# Altium project bdcmc_25.PrjPcb (part 1 of 2)
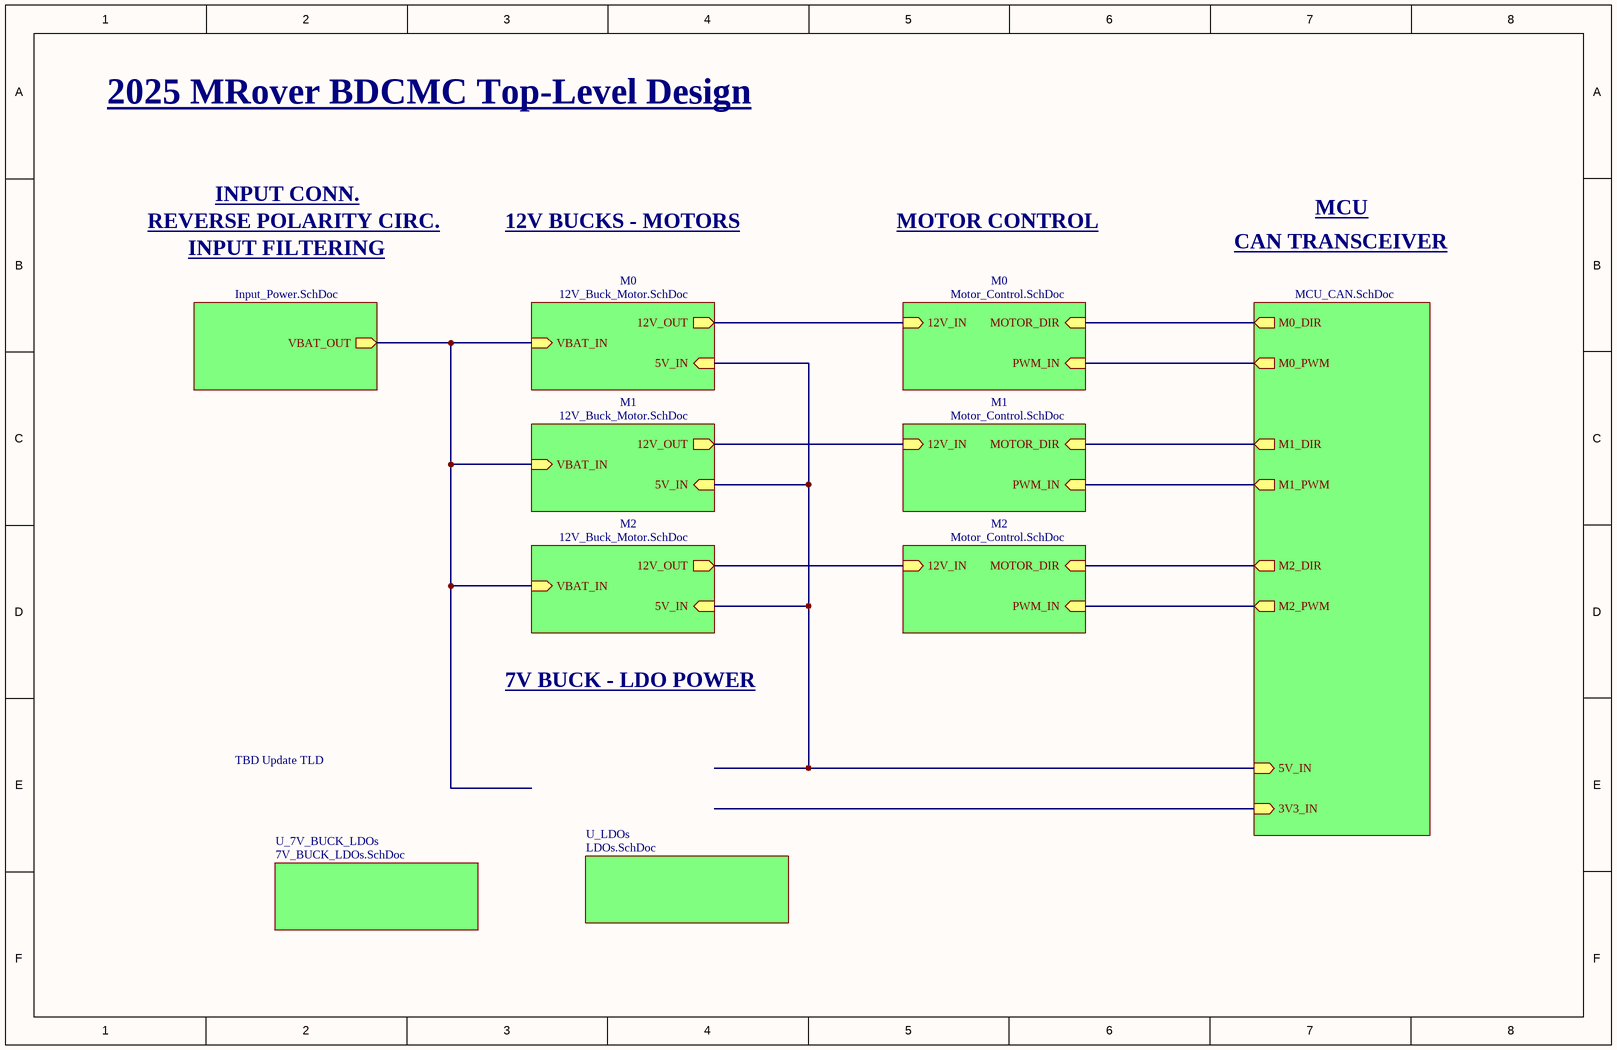
[diagram p0: TLD.SchDoc]
7 sheets, 368 parts. Net scope: hierarchical (ports join the sheet entries above them; power ports are global).
Board files: bdcmc25.PcbDoc, bdcmc25_revised.PcbDoc
Sheets:
  TLD.SchDoc
    Input Power = Input_Power.SchDoc
    M0 = 12V_Buck_Motor.SchDoc
    M1 = 12V_Buck_Motor.SchDoc
    M2 = 12V_Buck_Motor.SchDoc
    M0 = Motor_Control.SchDoc
    M1 = Motor_Control.SchDoc
    M2 = Motor_Control.SchDoc
    Designator = MCU_CAN.SchDoc
    U_7V_BUCK_LDOs = 7V_BUCK_LDOs.SchDoc
    U_LDOs = LDOs.SchDoc

## Sheet TLD.SchDoc
size 302 x 195 mm; SheetNumber: 1; SheetTotal: 7

### Sub-sheets
Designator = MCU_CAN.SchDoc: M0_DIR (out), M0_PWM (out), M1_DIR (out), M1_PWM (out), M2_DIR (out), M2_PWM (out), 5V_IN (in), 3V3_IN (in)
Input Power = Input_Power.SchDoc: VBAT_OUT (out)
M0 = 12V_Buck_Motor.SchDoc: VBAT_IN (in), 12V_OUT (out), 5V_IN (in)
M0 = Motor_Control.SchDoc: 12V_IN (in), MOTOR_DIR (in), PWM_IN (in)
M1 = 12V_Buck_Motor.SchDoc: VBAT_IN (in), 12V_OUT (out), 5V_IN (in)
M1 = Motor_Control.SchDoc: 12V_IN (in), MOTOR_DIR (in), PWM_IN (in)
M2 = 12V_Buck_Motor.SchDoc: VBAT_IN (in), 12V_OUT (out), 5V_IN (in)
M2 = Motor_Control.SchDoc: 12V_IN (in), MOTOR_DIR (in), PWM_IN (in)
U_7V_BUCK_LDOs = 7V_BUCK_LDOs.SchDoc: no entries
U_LDOs = LDOs.SchDoc: no entries

### Nets
5V: sheet M0/5V_IN, sheet M1/5V_IN, sheet M2/5V_IN, sheet Designator/5V_IN
12V_MOTOR: sheet M0/12V_OUT, sheet M1/12V_OUT, sheet M2/12V_OUT, sheet M0/12V_IN, sheet M1/12V_IN, sheet M2/12V_IN
VBAT: sheet Input Power/VBAT_OUT, sheet M0/VBAT_IN, sheet M1/VBAT_IN, sheet M2/VBAT_IN
MOTOR_DIR: sheet M0/MOTOR_DIR, sheet Designator/M0_DIR
MOTOR_DIR: sheet M1/MOTOR_DIR, sheet Designator/M1_DIR  [a separate net that carries the same name]
MOTOR_DIR: sheet M2/MOTOR_DIR, sheet Designator/M2_DIR  [a separate net that carries the same name]
PWM_IN: sheet M0/PWM_IN, sheet Designator/M0_PWM
PWM_IN: sheet M1/PWM_IN, sheet Designator/M1_PWM  [a separate net that carries the same name]
PWM_IN: sheet M2/PWM_IN, sheet Designator/M2_PWM  [a separate net that carries the same name]

### Notes on the sheet
- 2025 MRover BDCMC Top-Level Design
- REVERSE POLARITY CIRC.
- INPUT FILTERING
- INPUT CONN.
- 12V BUCKS - MOTORS
- MOTOR CONTROL
- CAN TRANSCEIVER
- MCU
- 7V BUCK - LDO POWER
- TBD Update TLD
- DWG. NO.
- REV.
- SHT.
- REVISION
- DESCRIPTION
- DATE
- APPROVED
- THIS DOCUMENT AND THE DATA DISCLOSED HEREIN OR HEREWITH IS THE PROPERTY OF ALTIUM LIMITED AND MAY BE FREELY DISTRIBUTED IN WHOLE. NO RIGHTS ARE RESERVED OR EXPRESS OR IMPLIED WARANTEE GIVEN.
- ENG:
- DSN:
- APPROVALS
- PROJECT
- DOCUMENT REVISION:
- DESIGN ITEM:
- CHK:
- BOM:
- REFERENCE DOCUMENTS
- PROJECT REVISION:
- TITLE
- FAB DWG:
- PCB DWG:
- ASSY DWG:
- SCALE:
- SIZE
- C
- CAGE CODE
- FILE NAME
- DWG NO.
- SHEET
- OF
- REV

## Sheet Input_Power.SchDoc
size 194 x 125 mm; SheetNumber: 2; SheetTotal: 7
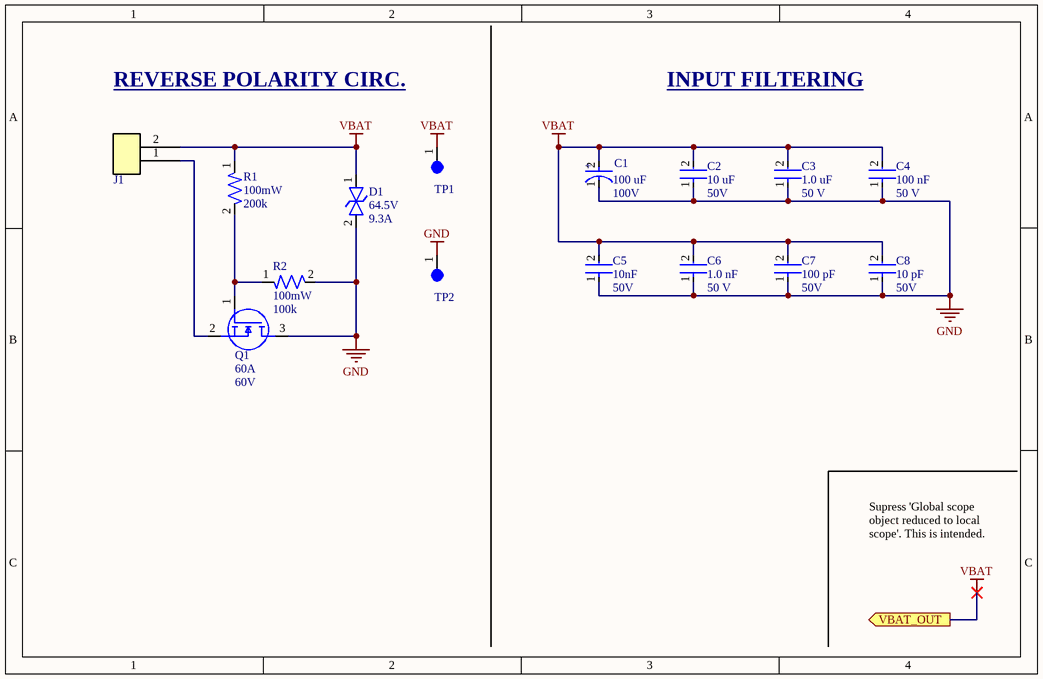
[diagram p1: Input_Power.SchDoc]

### Parts
C1  Voltage: 100V  Capacitance: 100 uF  [CAP-100U-0001]  (hidden comment: EEETK2A101AM)
C2  Voltage: 50V  Capacitance: 10 uF  [CAP-1210]  (hidden comment: CL32B106KBJNNNE)
C3  Voltage: 50 V  Capacitance: 1.0 uF  [CAP-0805]  (hidden comment: CC0805KKX7R9BB105)
C4  Voltage Rating: 50 V  Capacitance: 100 nF  [CAP-0805]  (hidden comment: CC0805KRX7R9BB104)
C5  Voltage: 50V  Capacitance: 10nF  [CAP-0805]  (hidden comment: GRM2195C1H103JA01D)
C6  Voltage: 50 V  Capacitance: 1.0 nF  [CAP-0402]  (hidden comment: CC0402KRX7R9BB102)
C7  Capacitance: 100 pF  Voltage: 50V  [CAP-0402]  (hidden comment: CC0402JRNPO9BN101)
C8  Capacitance: 10 pF  Voltage: 50V  [CAP-0402]  (hidden comment: CC0402JRNPO9BN100)
D1  Voltage Rating: 64.5V  Current Rating: 9.3A  [DO-214AA (SMBJ)]  (hidden comment: SMBJ40CA)
J1  0436500215  [CONN-2POS-0002]  (value not drawn)
Q1  Voltage: 60V  Continuous Current: 60A  [IC-8VSONCLIP]  (hidden comment: CSD18543Q3AT)
R1  Power: 100mW  Resistance: 200k  [RES-0603]  (hidden comment: RC0603FR-07200KL)
R2  Power: 100mW  Resistance: 100k  [RES-0603]  (hidden comment: RC0603FR-07100KL)
TP1  5003  [TEST-POINT-0001]  (value not drawn)
TP2  5003  [TEST-POINT-0001]  (value not drawn)

### Ports
VBAT_OUT (out, see TLD[7E])

### Nets
GND: C1.1 C2.1 C3.1 C4.1 C5.1 C6.1 C7.1 C8.1 D1.2 Q1.3(D) R2.2 TP2.1
VBAT: C1.2 C2.2 C3.2 C4.2 C5.2 C6.2 C7.2 C8.2 D1.1 J1.2 R1.1 TP1.1 ; port VBAT_OUT
NetJ1_1: J1.1 Q1.2(S)
NetQ1_1: Q1.1(G) R1.2 R2.1

### Notes on the sheet
- REVERSE POLARITY CIRC.
- INPUT FILTERING
- Supress 'Global scope object reduced to local scope'. This is intended.
- (in symbol CAP-100U-0001) +

### Library data of the parts
C1 = CAP-100U-0001: CAP ALUM 100UF 20% 100V SMD; Device Class: Electrolytic; ComponentLink1Description: Datasheet; ComponentLink1URL: https://industrial.panasonic.com/cdbs/www-data/pdf/RDE0000/ABA0000C1190.pdf
C2 = CAP-10U-0002: CAP CER 10UF 50V X7R 1210; Device Class: Ceramic; Size: 1210; ComponentLink1Description: Datasheet; ComponentLink1URL: https://mm.digikey.com/Volume0/opasdata/d220001/medias/docus/41/CL32B106KBJNNNE_Spec.pdf
C3 = CAP-1U-0001: CAP CER 1UF 50V X7R 0805; ComponentLink2URL: https://www.yageo.com/upload/media/product/productsearch/datasheet/mlcc/UPY-GPHC_X7R_6.3V-to-250V_24.pdf; ComponentLink2Description: Datasheet; Device Class: Ceramic; Size: 0805
C4 = CAP-0.1U-0002: CAP CER 0.1UF 50V X7R 0805; ComponentLink2Description: Datasheet; ComponentLink2URL: https://www.yageo.com/upload/media/product/productsearch/datasheet/mlcc/UPY-GPHC_X7R_6.3V-to-250V_24.pdf; Device Class: Ceramic; Size: 0805
C5 = CAP-10N-0001: CAP CER 10000PF 50V C0G/NP0 0805; Device Class: Ceramic; Size: 0805; ComponentLink1Description: Datasheet; ComponentLink1URL: https://search.murata.co.jp/Ceramy/image/img/A01X/G101/ENG/GRM2195C1H103JA01-01.pdf
C6 = CAP-1N-0001: CAP CER 1000PF 50V X7R 0402; ComponentLink2Description: Datasheet; ComponentLink2URL: http://www.yageo.com/documents/recent/UPY-GP_NP0_16V-to-50V_16.pdf; Device Class: Ceramic; Size: 0402
C7 = CAP-100P-0001: CAP CER 100PF 50V C0G/NPO 0402; Device Class: Ceramic; Size: 0402; ComponentLink1Description: Datasheet; ComponentLink1URL: https://www.yageo.com/upload/media/product/productsearch/datasheet/mlcc/UPY-GP_NP0_16V-to-50V_18.pdf
C8 = CAP-10P-0001: CAP CER 10PF 50V C0G/NPO 0402; Device Class: Ceramic; Size: 0402; ComponentLink1Description: Datasheet; ComponentLink1URL: https://www.yageo.com/upload/media/product/productsearch/datasheet/mlcc/UPY-GP_NP0_16V-to-50V_18.pdf
D1 = DIO-TVS-0001: TVS DIODE 40VWM 64.5VC DO214AA; ComponentLink1Description: Datasheet; ComponentLink1URL: https://www.littelfuse.com/media?resourcetype=datasheets&itemid=09a6ae9a-73cb-4ac4-acac-e6dab92ab953&filename=littelfuse_tvs_diode_smbj_datasheet.pdf
J1 = CONN-2POS-0002: CONN HEADER VERT 2POS 3MM; ComponentLink1Description: Datasheet; ComponentLink1URL: https://www.molex.com/content/dam/molex/molex-dot-com/products/automated/en-us/salesdrawingpdf/436/43650/436500215_sd.pdf?inline
Q1 = NMOS-60A-0001: MOSFET N-CH 60V 12A/60A 8VSON; ComponentLink2Description: Datasheet; ComponentLink2URL: http://www.ti.com/lit/ds/symlink/csd18543q3a.pdf
R1 = RES-200k-0001: RES SMD 200K OHM 1% 1/10W 0603; Tolerance: 1%; Size: 0603; ComponentLink1Description: Datasheet; ComponentLink1URL: https://www.yageo.com/upload/media/product/products/datasheet/rchip/PYu-RC_Group_51_RoHS_L_12.pdf
R2 = RES-100k-0001: RES SMD 100K OHM 1% 1/10W 0603; Tolerance: 1%; Size: 0603; ComponentLink1Description: Datasheet; ComponentLink1URL: https://www.yageo.com/upload/media/product/products/datasheet/rchip/PYu-RC_Group_51_RoHS_L_12.pdf
TP1 TP2 = TEST-POINT-0001: Oranange PC Test Point, Miniature Phoisphor Bronze Silver Plating Through Hole Mounting Type

## Sheet 12V_Buck_Motor.SchDoc
size 259 x 167 mm; SheetNumber: 3; SheetTotal: 7
Used 3 times, as channels M0, M1, M2. Parts and nets are listed once, with the designators drawn on the sheet.
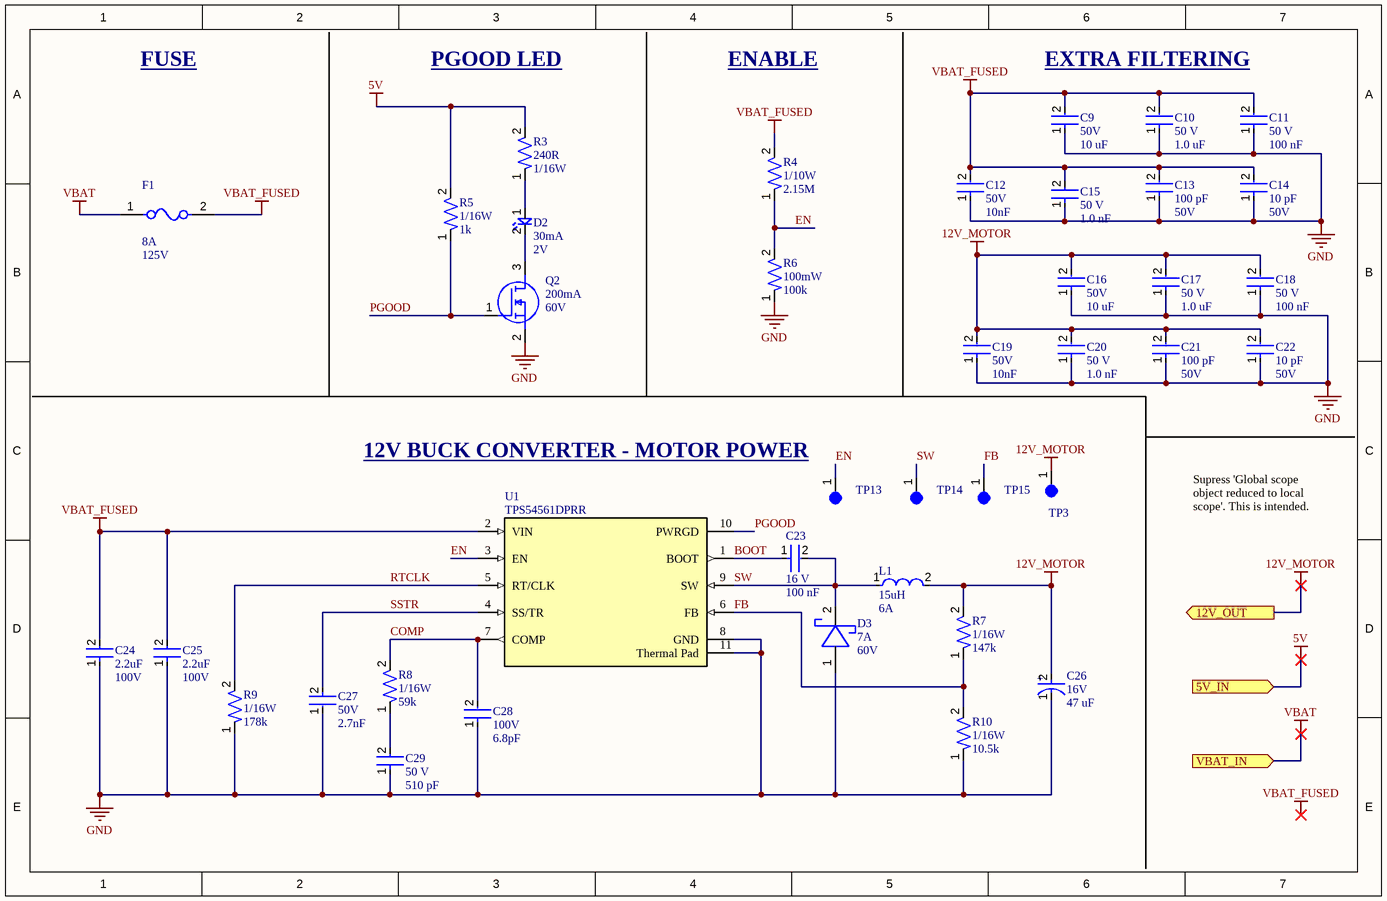
[diagram p2: 12V_Buck_Motor.SchDoc]

### Parts
C9  Voltage: 50V  Capacitance: 10 uF  [CAP-1210]  (hidden comment: CL32B106KBJNNNE)
C10  Voltage: 50 V  Capacitance: 1.0 uF  [CAP-0805]  (hidden comment: CC0805KKX7R9BB105)
C11  Voltage Rating: 50 V  Capacitance: 100 nF  [CAP-0805]  (hidden comment: CC0805KRX7R9BB104)
C12  Voltage: 50V  Capacitance: 10nF  [CAP-0805]  (hidden comment: GRM2195C1H103JA01D)
C13  Capacitance: 100 pF  Voltage: 50V  [CAP-0402]  (hidden comment: CC0402JRNPO9BN101)
C14  Capacitance: 10 pF  Voltage: 50V  [CAP-0402]  (hidden comment: CC0402JRNPO9BN100)
C15  Voltage: 50 V  Capacitance: 1.0 nF  [CAP-0402]  (hidden comment: CC0402KRX7R9BB102)
C16  Voltage: 50V  Capacitance: 10 uF  [CAP-1210]  (hidden comment: CL32B106KBJNNNE)
C17  Voltage: 50 V  Capacitance: 1.0 uF  [CAP-0805]  (hidden comment: CC0805KKX7R9BB105)
C18  Voltage Rating: 50 V  Capacitance: 100 nF  [CAP-0805]  (hidden comment: CC0805KRX7R9BB104)
C19  Voltage: 50V  Capacitance: 10nF  [CAP-0805]  (hidden comment: GRM2195C1H103JA01D)
C20  Voltage: 50 V  Capacitance: 1.0 nF  [CAP-0402]  (hidden comment: CC0402KRX7R9BB102)
C21  Capacitance: 100 pF  Voltage: 50V  [CAP-0402]  (hidden comment: CC0402JRNPO9BN101)
C22  Capacitance: 10 pF  Voltage: 50V  [CAP-0402]  (hidden comment: CC0402JRNPO9BN100)
C23  Voltage Rating: 16 V  Capacitance: 100 nF  [CAP-0402]  (hidden comment: CC0402KRX7R7BB104)
C24  Capacitance: 2.2uF  Voltage: 100V  [CAP-1206]  (hidden comment: CC1206KKX7R0BB225)
C25  Capacitance: 2.2uF  Voltage: 100V  [CAP-1206]  (hidden comment: CC1206KKX7R0BB225)
C26  Voltage: 16V  Capacitance: 47 uF  [CAP-47U-0001]  (hidden comment: 16SVPG47M)
C27  Voltage: 50V  Capacitance: 2.7nF  [CAP-0805]  (hidden comment: GRM2165C1H272JA01D)
C28  Voltage: 100V  Capacitance: 6.8pF  [CAP-0603]  (hidden comment: CC0603CRNPO0BN6R8)
C29  Voltage: 50 V  Capacitance: 510 pF  [CAP-0402]  (hidden comment: 0402N511J500CT)
D2  Forward Current: 30mA  Forward Voltage: 2V  [LED-0603]  (hidden comment: BL-HKC36G-AV-TRB)
D3  Forward Current: 7A  Reverse Voltage (DC): 60V  [DO-POWERDI5]  (hidden comment: PDS760-13)
F1  Fuse Current: 8A  Voltage Rating: 125V  [FUSE-0001]  (hidden comment: 01550900M)
L1  Inductance: 15uH  Current Rating: 6A  [IND-15U-0002]  (hidden comment: CSAD1010-150M)
Q2  Continuous Current: 200mA  Voltage: 60V  [IC-SOT23-3]  (hidden comment: T2N7002AK,LM)
R3  Resistance: 240R  Power: 1/16W  [RES-0402]  (hidden comment: RC0402FR-07240RL)
R4  Power: 1/10W  Resistance: 2.15M  [RES-0603]  (hidden comment: RC0603FR-072M15L)
R5  Power: 1/16W  Resistance: 1k  [RES-0402]  (hidden comment: RC0402FR-071KL)
R6  Power: 100mW  Resistance: 100k  [RES-0603]  (hidden comment: RC0603FR-07100KL)
R7  Power: 1/16W  Resistance: 147k  [RES-0402]  (hidden comment: RC0402FR-07147KL)
R8  Power: 1/16W  Resistance: 59k  [RES-0402]  (hidden comment: RC0402FR-0759KL)
R9  Power: 1/16W  Resistance: 178k  [RES-0402]  (hidden comment: RTT021783FTH)
R10  Power: 1/16W  Resistance: 10.5k  [RES-0402]  (hidden comment: RC0402FR-0710K5L)
TP3  5003  [TEST-POINT-0001]  (value not drawn)
TP13  5003  [TEST-POINT-0001]  (value not drawn)
TP14  5003  [TEST-POINT-0001]  (value not drawn)
TP15  5003  [TEST-POINT-0001]  (value not drawn)
U1  TPS54561DPRR  [IC-10WSON]

### Ports
5V_IN (in, see TLD[5D], 7V_BUCK_LDOs[2B], MCU_CAN[7E]), 12V_OUT (out, see TLD[5E]), VBAT_IN (in, see TLD[6E], 7V_BUCK_LDOs[2B])

### Nets
5V: R3.2 R5.2 ; port 5V_IN
12V_MOTOR: C16.2 C17.2 C18.2 C19.2 C20.2 C21.2 C22.2 C26.2(A) L1.2 R7.2 TP3.1 ; port 12V_OUT
GND: C9.1 C10.1 C11.1 C12.1 C13.1 C14.1 C15.1 C16.1 C17.1 C18.1 C19.1 C20.1 C21.1 C22.1 C24.1 C25.1 C26.1(C) C27.1 C28.1 C29.1 D3.1(CATHODE) Q2.2(S) R6.1 R9.1 R10.1 U1.8(GND) U1.11(Thermal_Pad)
VBAT: F1.1 ; port VBAT_IN
VBAT_FUSED: C9.2 C10.2 C11.2 C12.2 C13.2 C14.2 C15.2 C24.2 C25.2 F1.2 R4.2 U1.2(VIN)
BOOT: C23.1 U1.1(BOOT)
COMP: C28.2 R8.2 U1.7(COMP)
EN: R4.1 R6.2 TP13.1 U1.3(EN)
FB: R7.1 R10.2 TP15.1 U1.6(FB)
PGOOD: Q2.1(G) R5.1 U1.10(PWRGD)
RTCLK: R9.2 U1.5(RT/CLK)
SSTR: C27.2 U1.4(SS/TR)
SW: C23.2 D3.2(ANODE) L1.1 TP14.1 U1.9(SW)
NetC29_2: C29.2 R8.1
NetD2_1: D2.1 R3.1
NetD2_2: D2.2 Q2.3(D)

### Channels
M0: designators end in _M0; ports 5V_IN=5V 12V_OUT=12V_MOTOR VBAT_IN=VBAT
M1: designators end in _M1; ports 5V_IN=5V 12V_OUT=12V_MOTOR VBAT_IN=VBAT
M2: designators end in _M2; ports 5V_IN=5V 12V_OUT=12V_MOTOR VBAT_IN=VBAT

### Notes on the sheet
- FUSE
- PGOOD LED
- ENABLE
- EXTRA FILTERING
- 12V BUCK CONVERTER - MOTOR POWER
- Supress 'Global scope object reduced to local scope'. This is intended.
- Labels drawn without touching a wire or pin: VBAT_FUSED
- DWG. NO.
- REV.
- SHT.
- REVISION
- DESCRIPTION
- DATE
- APPROVED
- THIS DOCUMENT AND THE DATA DISCLOSED HEREIN OR HEREWITH IS THE PROPERTY OF ALTIUM LIMITED AND MAY BE FREELY DISTRIBUTED IN WHOLE. NO RIGHTS ARE RESERVED OR EXPRESS OR IMPLIED WARANTEE GIVEN.
- ENG:
- DSN:
- APPROVALS
- PROJECT
- DOCUMENT REVISION:
- DESIGN ITEM:
- CHK:
- BOM:
- REFERENCE DOCUMENTS
- PROJECT REVISION:
- TITLE
- FAB DWG:
- PCB DWG:
- ASSY DWG:
- SCALE:
- SIZE
- C
- CAGE CODE
- FILE NAME
- DWG NO.
- SHEET
- OF
- REV
- (in symbol CAP-47U-0001) +

### Library data of the parts
C9 C16 = CAP-10U-0002: CAP CER 10UF 50V X7R 1210; Device Class: Ceramic; Size: 1210; ComponentLink1Description: Datasheet; ComponentLink1URL: https://mm.digikey.com/Volume0/opasdata/d220001/medias/docus/41/CL32B106KBJNNNE_Spec.pdf
C10 C17 = CAP-1U-0001: CAP CER 1UF 50V X7R 0805; ComponentLink2URL: https://www.yageo.com/upload/media/product/productsearch/datasheet/mlcc/UPY-GPHC_X7R_6.3V-to-250V_24.pdf; ComponentLink2Description: Datasheet; Device Class: Ceramic; Size: 0805
C11 C18 = CAP-0.1U-0002: CAP CER 0.1UF 50V X7R 0805; ComponentLink2Description: Datasheet; ComponentLink2URL: https://www.yageo.com/upload/media/product/productsearch/datasheet/mlcc/UPY-GPHC_X7R_6.3V-to-250V_24.pdf; Device Class: Ceramic; Size: 0805
C12 C19 = CAP-10N-0001: CAP CER 10000PF 50V C0G/NP0 0805; Device Class: Ceramic; Size: 0805; ComponentLink1Description: Datasheet; ComponentLink1URL: https://search.murata.co.jp/Ceramy/image/img/A01X/G101/ENG/GRM2195C1H103JA01-01.pdf
C13 C21 = CAP-100P-0001: CAP CER 100PF 50V C0G/NPO 0402; Device Class: Ceramic; Size: 0402; ComponentLink1Description: Datasheet; ComponentLink1URL: https://www.yageo.com/upload/media/product/productsearch/datasheet/mlcc/UPY-GP_NP0_16V-to-50V_18.pdf
C14 C22 = CAP-10P-0001: CAP CER 10PF 50V C0G/NPO 0402; Device Class: Ceramic; Size: 0402; ComponentLink1Description: Datasheet; ComponentLink1URL: https://www.yageo.com/upload/media/product/productsearch/datasheet/mlcc/UPY-GP_NP0_16V-to-50V_18.pdf
C15 C20 = CAP-1N-0001: CAP CER 1000PF 50V X7R 0402; ComponentLink2Description: Datasheet; ComponentLink2URL: http://www.yageo.com/documents/recent/UPY-GP_NP0_16V-to-50V_16.pdf; Device Class: Ceramic; Size: 0402
C23 = CAP-0.1U-0001: CAP CER 0.1UF 16V X7R 0402; ComponentLink2Description: Datasheet; ComponentLink2URL: https://www.yageo.com/upload/media/product/productsearch/datasheet/mlcc/UPY-GPHC_X7R_6.3V-to-250V_24.pdf; Device Class: Ceramic; Size: 0402
C24 C25 = CAP-2.2U-0001: CAP CER 2.2UF 100V X7R 1206; Device Class: Ceramic; Size: 1206; ComponentLink1Description: Datasheet; ComponentLink1URL: https://www.yageo.com/upload/media/product/productsearch/datasheet/mlcc/UPY-GPHC_X7R_6.3V-to-250V_24.pdf
C26 = CAP-47U-0001: CAP ALUM POLY 47UF 20% 16V SMD; Device Class: Electrolytic; ComponentLink1Description: Datasheet; ComponentLink1URL: https://industrial.panasonic.com/cdbs/www-data/pdf/AAB8000/AAB8000C175.pdf
C27 = CAP-2.7N-0001: CAP CER 2700PF 50V C0G/NP0 0805; ComponentLink1Description: Datasheet; ComponentLink1URL: https://search.murata.co.jp/Ceramy/image/img/A01X/G101/ENG/GRM2165C1H272JA01-01.pdf; Device Class: Ceramic; Size: 0805
C28 = CAP-6.8P-0001: CAP CER 6.8PF 100V C0G/NPO 0603; Device Class: Ceramic; ComponentLink1Description: Datasheet; ComponentLink1URL: https://www.yageo.com/upload/media/product/productsearch/datasheet/mlcc/UPY-GPHC_X7R_6.3V-to-250V_24.pdf; Size: 0603
C29 = CAP-510P-0001: CAP CER 510PF 50V C0G/NP0 0402; ComponentLink2Description: Datasheet; ComponentLink2URL: https://www.mouser.com/ProductDetail/Walsin/0402N511J500CT?qs=u16ybLDytRbq33ukPPRl4A%3D%3D&srsltid=AfmBOoq1-HCbTRqPV3GtwyI6lHLBf095DSA3Qg1Qkiix4a-obr82TmJ6; Device Class: Ceramic; Size: 0402
D2 = LED-0001: LED YELLOW CLEAR 0603 SMD; ComponentLink1Description: Datasheet; ComponentLink1URL: https://www.americanbrightled.com/pdffiles/led-components/smt/BL-HKC36G-AV-TRB.pdf
D3 = DIO-SCHOTTKY-0001: DIODE SCHOTTKY 60V 7A POWERDI5; ComponentLink1Description: Datasheet; ComponentLink1URL: https://www.diodes.com/assets/Datasheets/PDS760.pdf
F1 = FUSE-0001: FUSE BLOK CARTRIDGE 125V 10A SMD; ComponentLink2Description: Datasheet; ComponentLink2URL: https://www.littelfuse.com/~/media/electronics/datasheets/fuses/littelfuse_fuse_154_154t_154l_154tl_datasheet.pdf.pdf
L1 = IND-15U-0002-NoJLC: SMD MOLDING POWER CHOKE; ComponentLink1Description: Datasheet; ComponentLink1URL: https://www.digikey.com/en/products/detail/codaca/CSAD1010-150M/16633512?s=N4IgjCBcoBwAxVAYygMwIYBsDOBTANCAPZQDaIALHAExwDMEAuoQA4AuUIAymwE4CWAOwDmIAL6Ew1MAE5EIFJAw4CxMiGoy6AdmoUQhajGqa6BjTDp6zhywFY4c23UtOLFbVXPVtYK3e9dODsbdwA2OxgQZhB2Th4BEXFJTQhoBTQsPEISSHITS0do1g5Ibj4hUQkNOBhteTiygFVBfjYAeVQAWVx0bABXXlxzfs4AVoAJcwBbIU4wAMJp9AAPeYDq2hgo9MaQFrbOnr7B4cJRsoBBGbmyuwA6DcIAWmp5RT5%2B1VzyAMYxAFAA
Q2 = NMOS-200MA-0001: MOSFET N-CH 60V 200MA SOT23; ComponentLink1Description: Datasheet; ComponentLink1URL: https://toshiba.semicon-storage.com/info/T2N7002AK_datasheet_en_20150401.pdf?did=29712&prodName=T2N7002AK
R3 = RES-240-0001: 240R 0.063W 1% 0402 (1005 Metric)  SMD; Tolerance: 1%; Size: 0402; ComponentLink1Description: Datasheet; ComponentLink1URL: https://www.yageo.com/upload/media/product/products/datasheet/rchip/PYu-RC_Group_51_RoHS_L_12.pdf
R4 = RES-2.15M-0001: RES SMD 2.15M OHM 1% 1/10W 0603; Tolerance: 1%; Size: 0603; ComponentLink1Description: Datasheet; ComponentLink1URL: https://www.yageo.com/upload/media/product/products/datasheet/rchip/PYu-RC_Group_51_RoHS_L_12.pdf
R5 = RES-1k-0001: RES 1K OHM 1% 1/16W 0402; Tolerance: 1%; Size: 0402; ComponentLink1Description: Datasheet; ComponentLink1URL: https://www.yageo.com/upload/media/product/products/datasheet/rchip/PYu-RC_Group_51_RoHS_L_12.pdf
R6 = RES-100k-0001: RES SMD 100K OHM 1% 1/10W 0603; Tolerance: 1%; Size: 0603; ComponentLink1Description: Datasheet; ComponentLink1URL: https://www.yageo.com/upload/media/product/products/datasheet/rchip/PYu-RC_Group_51_RoHS_L_12.pdf
R7 = RES-147k-0001: RES 147K OHM 1% 1/16W 0402; Tolerance: 1%; Size: 0402; ComponentLink1Description: Datasheet; ComponentLink1URL: https://www.yageo.com/upload/media/product/products/datasheet/rchip/PYu-RC_Group_51_RoHS_L_12.pdf
R8 = RES-59k-0001: RES 59K OHM 1% 1/16W 0402; Tolerance: 1%; Size: 0402; ComponentLink1Description: Datasheet; ComponentLink1URL: https://www.digikey.com/en/products/detail/yageo/RC0402FR-0759KL/2827634?s=N4IgTCBcDaIEoGEAMAWJYBicC0SDsArAJwDSAMiALoC%2BQA
R9 = RES-178k-0001: 62.5mW Thick Film Resistors 50V ±100ppm/℃ ±1% 178kΩ 0402 Chip Resistor - Surface Mount ROHS; Tolerance: 1%; Size: 0402; ComponentLink1Description: Datasheet; ComponentLink1URL: https://www.lcsc.com/datasheet/lcsc_datasheet_2304140030_RALEC-RTT021783FTH_C102842.pdf
R10 = RES-10.5k-0001: RES 10.5K OHM 1% 1/16W 0402; Tolerance: 1%; Size: 0402; ComponentLink1Description: Datasheet; ComponentLink1URL: https://www.yageo.com/upload/media/product/products/datasheet/rchip/PYu-RC_Group_51_RoHS_L_12.pdf
TP3 TP13-TP15 = TEST-POINT-0001: as TP1 on sheet Input_Power
U1 = IC-BUCK-0001: IC REG BUCK ADJ 5A 10WSON; ComponentLink1Description: Datasheet; ComponentLink1URL: https://www.ti.com/general/docs/suppproductinfo.tsp?distId=10&gotoUrl=https%3A%2F%2Fwww.ti.com%2Flit%2Fgpn%2Ftps54561

## Sheet Motor_Control.SchDoc
size 310 x 201 mm; SheetNumber: 6; SheetTotal: 7
Used 3 times, as channels M0, M1, M2. Parts and nets are listed once, with the designators drawn on the sheet.
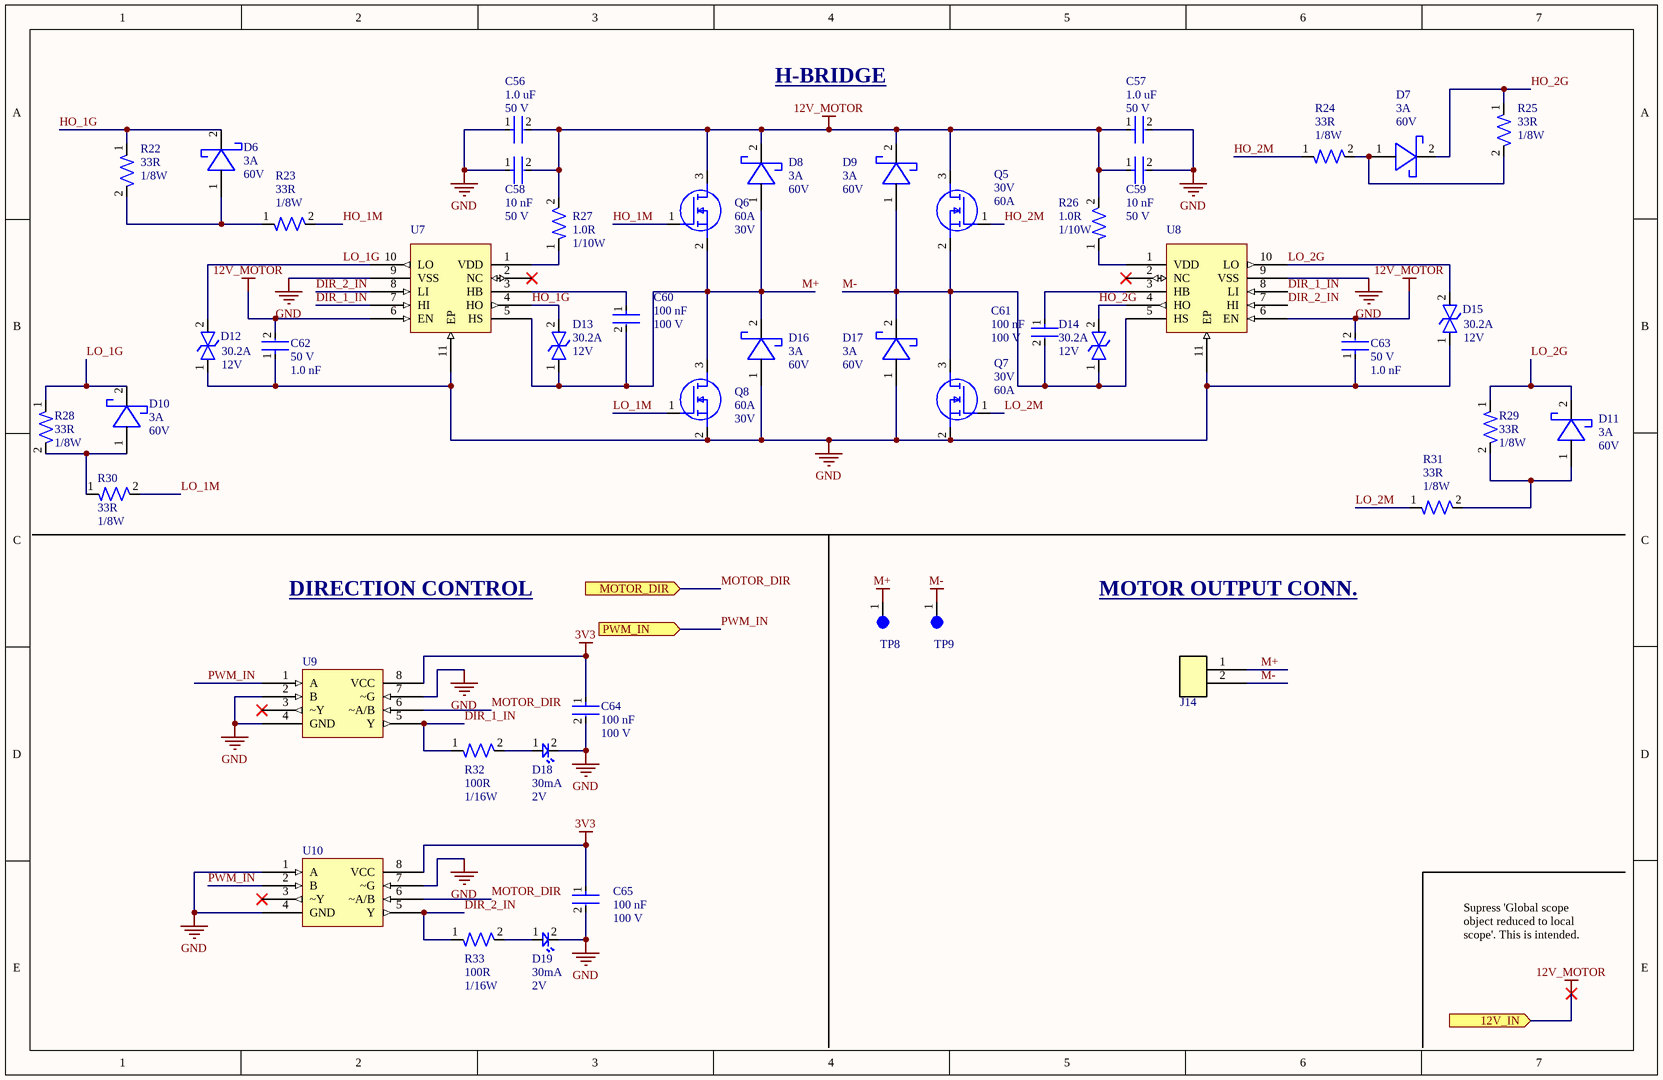
[diagram p3: Motor_Control.SchDoc]

### Parts
C56  Voltage: 50 V  Capacitance: 1.0 uF  [CAP-0805]  (hidden comment: CC0805KKX7R9BB105)
C57  Voltage: 50 V  Capacitance: 1.0 uF  [CAP-0805]  (hidden comment: CC0805KKX7R9BB105)
C58  Voltage: 50 V  Capacitance: 10 nF  [CAP-0603]  (hidden comment: CC0603KPX7R9BB103)
C59  Voltage: 50 V  Capacitance: 10 nF  [CAP-0603]  (hidden comment: CC0603KPX7R9BB103)
C60  Capacitance: 100 nF  Voltage: 100 V  [CAP-0603]  (hidden comment: CC0603KRX7R0BB104)
C61  Capacitance: 100 nF  Voltage: 100 V  [CAP-0603]  (hidden comment: CC0603KRX7R0BB104)
C62  Voltage: 50 V  Capacitance: 1.0 nF  [CAP-0402]  (hidden comment: CC0402KRX7R9BB102)
C63  Voltage: 50 V  Capacitance: 1.0 nF  [CAP-0402]  (hidden comment: CC0402KRX7R9BB102)
C64  Capacitance: 100 nF  Voltage: 100 V  [CAP-0603]  (hidden comment: CC0603KRX7R0BB104)
C65  Capacitance: 100 nF  Voltage: 100 V  [CAP-0603]  (hidden comment: CC0603KRX7R0BB104)
D6  Current Rating: 3A  Reverse Voltage: 60V  [DIO-SOD128]  (hidden comment: PMEG6030EP,115)
D7  Current Rating: 3A  Reverse Voltage: 60V  [DIO-SOD128]  (hidden comment: PMEG6030EP,115)
D8  Current Rating: 3A  Reverse Voltage: 60V  [DIO-SOD128]  (hidden comment: PMEG6030EP,115)
D9  Current Rating: 3A  Reverse Voltage: 60V  [DIO-SOD128]  (hidden comment: PMEG6030EP,115)
D10  Current Rating: 3A  Reverse Voltage: 60V  [DIO-SOD128]  (hidden comment: PMEG6030EP,115)
D11  Current Rating: 3A  Reverse Voltage: 60V  [DIO-SOD128]  (hidden comment: PMEG6030EP,115)
D12  Standoff Voltage: 12V  Current Rating: 30.2A  [DO-214AA (SMBJ)]  (hidden comment: SMBJ12CA)
D13  Standoff Voltage: 12V  Current Rating: 30.2A  [DO-214AA (SMBJ)]  (hidden comment: SMBJ12CA)
D14  Standoff Voltage: 12V  Current Rating: 30.2A  [DO-214AA (SMBJ)]  (hidden comment: SMBJ12CA)
D15  Standoff Voltage: 12V  Current Rating: 30.2A  [DO-214AA (SMBJ)]  (hidden comment: SMBJ12CA)
D16  Current Rating: 3A  Reverse Voltage: 60V  [DIO-SOD128]  (hidden comment: PMEG6030EP,115)
D17  Current Rating: 3A  Reverse Voltage: 60V  [DIO-SOD128]  (hidden comment: PMEG6030EP,115)
D18  Forward Current: 30mA  Forward Voltage: 2V  [LED-0603]  (hidden comment: BL-HKC36G-AV-TRB)
D19  Forward Current: 30mA  Forward Voltage: 2V  [LED-0603]  (hidden comment: BL-HKC36G-AV-TRB)
J14  0430450212  [CONN-2POS-0001]  (value not drawn)
Q5  Voltage: 30V  Continuous Current: 60A  [IC-8VSONCLIP]  (hidden comment: CSD17575Q3)
Q6  Voltage: 30V  Continuous Current: 60A  [IC-8VSONCLIP]  (hidden comment: CSD17575Q3)
Q7  Voltage: 30V  Continuous Current: 60A  [IC-8VSONCLIP]  (hidden comment: CSD17575Q3)
Q8  Voltage: 30V  Continuous Current: 60A  [IC-8VSONCLIP]  (hidden comment: CSD17575Q3)
R22  Resistance: 33R  Power: 1/8W  [RES-0402]  (hidden comment: RC0402FR-7W33RL)
R23  Resistance: 33R  Power: 1/8W  [RES-0402]  (hidden comment: RC0402FR-7W33RL)
R24  Resistance: 33R  Power: 1/8W  [RES-0402]  (hidden comment: RC0402FR-7W33RL)
R25  Resistance: 33R  Power: 1/8W  [RES-0402]  (hidden comment: RC0402FR-7W33RL)
R26  Resistance: 1.0R  Power: 1/10W  [RES-0402]  (hidden comment: ERJ2GEJ1R0X)
R27  Resistance: 1.0R  Power: 1/10W  [RES-0402]  (hidden comment: ERJ2GEJ1R0X)
R28  Resistance: 33R  Power: 1/8W  [RES-0402]  (hidden comment: RC0402FR-7W33RL)
R29  Resistance: 33R  Power: 1/8W  [RES-0402]  (hidden comment: RC0402FR-7W33RL)
R30  Resistance: 33R  Power: 1/8W  [RES-0402]  (hidden comment: RC0402FR-7W33RL)
R31  Resistance: 33R  Power: 1/8W  [RES-0402]  (hidden comment: RC0402FR-7W33RL)
R32  Power: 1/16W  Resistance: 100R  [RES-0402]  (hidden comment: RC0402FR-07100RL)
R33  Power: 1/16W  Resistance: 100R  [RES-0402]  (hidden comment: RC0402FR-07100RL)
TP8  5003  [TEST-POINT-0001]  (value not drawn)
TP9  5003  [TEST-POINT-0001]  (value not drawn)
U7  UCC27282DRCR  [IC-10VSON]  (value not drawn)
U8  UCC27282DRCR  [IC-10VSON]  (value not drawn)
U9  SN74LVC2G157DCUR  [IC-8VSSOP]  (value not drawn)
U10  SN74LVC2G157DCUR  [IC-8VSSOP]  (value not drawn)

### Ports
12V_IN (in, see TLD[4E]), MOTOR_DIR (in, see TLD[3E]), PWM_IN (in, see TLD[3D])

### Nets
3V3: C64.1 C65.1 U9.8(VCC) U10.8(VCC)
12V_MOTOR: C56.2 C57.1 C58.2 C59.1 C62.2 C63.2 D8.2(ANODE) D9.2(ANODE) Q5.3(D) Q6.3(D) R26.2 R27.2 U7.6(EN) U8.6(EN) ; port 12V_IN
GND: C56.1 C57.2 C58.1 C59.2 C62.1 C63.1 C64.2 C65.2 D12.1 D15.1 D16.1(CATHODE) D17.1(CATHODE) D18.2 D19.2 Q7.2(S) Q8.2(S) U7.9(VSS) U7.11(EP) U8.9(VSS) U8.11(EP) U9.2(B) U9.4(GND) U9.7(~G) U10.1(A) U10.4(GND) U10.7(~G)
M+: C60.2 D8.1(CATHODE) D13.1 D16.2(ANODE) J14.1 Q6.2(S) Q8.3(D) TP8.1 U7.5(HS)
M-: C61.2 D9.1(CATHODE) D14.1 D17.2(ANODE) J14.2 Q5.2(S) Q7.3(D) TP9.1 U8.5(HS)
DIR_1_IN: R32.1 U7.7(HI) U8.8(LI) U9.5(Y)
DIR_2_IN: R33.1 U7.8(LI) U8.7(HI) U10.5(Y)
HO_1G: D6.2(ANODE) D13.2 R22.1 U7.4(HO)
HO_1M: Q6.1(G) R23.2
HO_2G: D7.2(ANODE) D14.2 R25.1 U8.4(HO)
HO_2M: Q5.1(G) R24.1
LO_1G: D10.2(ANODE) D12.2 R28.1 U7.10(LO)
LO_1M: Q8.1(G) R30.2
LO_2G: D11.2(ANODE) D15.2 R29.1 U8.10(LO)
LO_2M: Q7.1(G) R31.1
MOTOR_DIR: U9.6(~A/B) U10.6(~A/B) ; port MOTOR_DIR
PWM_IN: U9.1(A) U10.2(B) ; port PWM_IN
NetC60_1: C60.1 U7.3(HB)
NetC61_1: C61.1 U8.3(HB)
NetD6_1: D6.1(CATHODE) R22.2 R23.1
NetD7_1: D7.1(CATHODE) R24.2 R25.2
NetD10_1: D10.1(CATHODE) R28.2 R30.1
NetD11_1: D11.1(CATHODE) R29.2 R31.2
NetD18_1: D18.1 R32.2
NetD19_1: D19.1 R33.2
NetR26_1: R26.1 U8.1(VDD)
NetR27_1: R27.1 U7.1(VDD)

Not connected (* = marked no-connect by the designer): U7 2(NC)*; U8 2(NC)*; U9 3(~Y)*; U10 3(~Y)*

### Channels
M0: designators end in _M0; ports 12V_IN=12V_MOTOR MOTOR_DIR=MOTOR_DIR PWM_IN=PWM_IN
M1: designators end in _M1; ports 12V_IN=12V_MOTOR MOTOR_DIR=MOTOR_DIR PWM_IN=PWM_IN
M2: designators end in _M2; ports 12V_IN=12V_MOTOR MOTOR_DIR=MOTOR_DIR PWM_IN=PWM_IN

### Notes on the sheet
- H-BRIDGE
- DIRECTION CONTROL
- MOTOR OUTPUT CONN.
- Supress 'Global scope object reduced to local scope'. This is intended.

### Library data of the parts
C56 C57 = CAP-1U-0001: CAP CER 1UF 50V X7R 0805; ComponentLink2URL: https://www.yageo.com/upload/media/product/productsearch/datasheet/mlcc/UPY-GPHC_X7R_6.3V-to-250V_24.pdf; ComponentLink2Description: Datasheet; Device Class: Ceramic; Size: 0805
C58 C59 = CAP-10N-0002: CAP CER 10000PF 50V X7R 0603; ComponentLink2Description: Datasheet; ComponentLink2URL: http://www.yageo.com/documents/recent/UPY-GPHC_X7R_6.3V-to-50V_18.pdf; Device Class: Ceramic; Size: 0603
C60 C61 C64 C65 = CAP-100N-0001: CAP CER 0.1UF 100V X7R 0603; Device Class: Ceramic; Size: 0603; ComponentLink1Description: Datasheet; ComponentLink1URL: https://www.yageo.com/upload/media/product/app/datasheet/mlcc/upy-np0x7r_mv_100-to-630v.pdf
C62 C63 = CAP-1N-0001: CAP CER 1000PF 50V X7R 0402; ComponentLink2Description: Datasheet; ComponentLink2URL: http://www.yageo.com/documents/recent/UPY-GP_NP0_16V-to-50V_16.pdf; Device Class: Ceramic; Size: 0402
D6-D11 D16 D17 = DIO-SCHOTTKY-0003: DIODE SCHOTTKY 60V 3A SOD128; ComponentLink1Description: Datasheet; ComponentLink1URL: https://assets.nexperia.com/documents/data-sheet/PMEG6030EP.pdf
D12-D15 = DIO-TVS-0002: TVS DIODE 12VWM 19.9VC DO214AA; ComponentLink1Description: Datasheet; ComponentLink1URL: https://www.littelfuse.com/media?resourcetype=datasheets&itemid=09a6ae9a-73cb-4ac4-acac-e6dab92ab953&filename=littelfuse_tvs_diode_smbj_datasheet.pdf
D18 D19 = LED-0001: LED YELLOW CLEAR 0603 SMD; ComponentLink1Description: Datasheet; ComponentLink1URL: https://www.americanbrightled.com/pdffiles/led-components/smt/BL-HKC36G-AV-TRB.pdf
J14 = CONN-2POS-0001: CONN HEADER VERT 2POS; ComponentLink1Description: Datasheet; ComponentLink1URL: https://tools.molex.com/pdm_docs/ps/PS-43045.pdf
Q5-Q8 = NMOS-26A-0001: MOSFET N-CH 30V 60A 8VSON; ComponentLink1Description: Datasheet; ComponentLink1URL: https://www.ti.com/lit/ds/symlink/csd17575q3.pdf?ts=1728565072242&ref_url=https%253A%252F%252Fwww.mouser.co.uk%252F
R22-R25 R28-R31 = RES-33-0001: RES 33 OHM 1% 1/8W 0402; Tolerance: 1%; Size: 0402; ComponentLink1Description: Datasheet; ComponentLink1URL: https://www.yageo.com/upload/media/product/products/datasheet/rchip/PYu-RC_Group_51_RoHS_L_12.pdf
R26 R27 = RES-1-0001: RES SMD 1 OHM 5% 1/10W 0402; Tolerance: 5%; ComponentLink1Description: Datasheet; ComponentLink1URL: https://api.pim.na.industrial.panasonic.com/file_stream/main/fileversion/1242; Size: 0402
R32 R33 = RES-100-0001: RES 100 OHM 1% 1/16W 0402; Tolerance: 1%; Size: 0402; ComponentLink1Description: Datasheet; ComponentLink1URL: https://www.yageo.com/upload/media/product/products/datasheet/rchip/PYu-RC_Group_51_RoHS_L_12.pdf
TP8 TP9 = TEST-POINT-0001: as TP1 on sheet Input_Power
U7 U8 = IC-GTDR-0001: IC GATE DRVR HALF-BRIDGE 10VSON; VCC Max: 16; Package: 10-VSON; ComponentLink1Description: Datasheet; ComponentLink1URL: https://www.ti.com/lit/ds/symlink/ucc27282.pdf?HQS=dis-dk-null-digikeymode-dsf-pf-null-wwe&ts=1728563165008&ref_url=https%253A%252F%252Fwww.ti.com
U9 U10 = IC-MUX-0001: Multiplexer 1 x 2:1 8-VSSOP; ComponentLink1Description: Datasheet; ComponentLink1URL: https://www.ti.com/general/docs/suppproductinfo.tsp?distId=10&gotoUrl=https%3A%2F%2Fwww.ti.com%2Flit%2Fgpn%2Fsn74lvc2g157

## Sheet MCU_CAN.SchDoc
size 310 x 201 mm; SheetNumber: 7; SheetTotal: 7
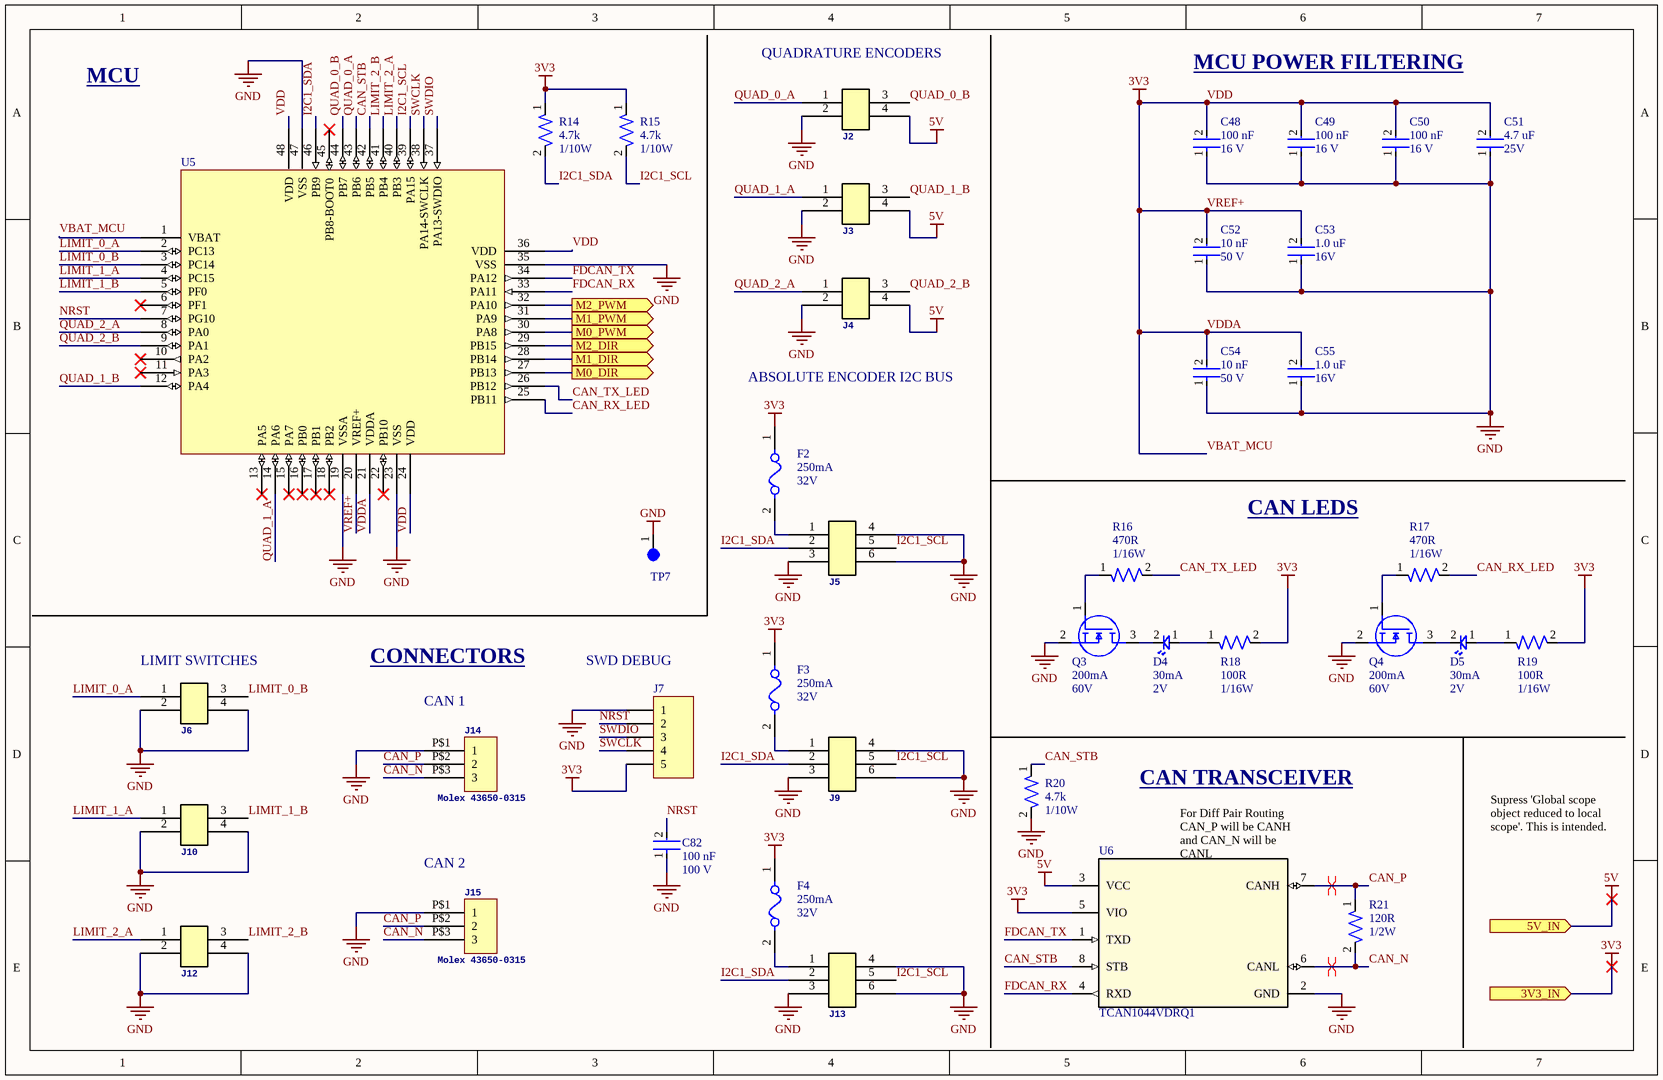
[diagram p4: MCU_CAN.SchDoc]

### Parts
C48  Voltage Rating: 16 V  Capacitance: 100 nF  [CAP-0402]  (hidden comment: CC0402KRX7R7BB104)
C49  Voltage Rating: 16 V  Capacitance: 100 nF  [CAP-0402]  (hidden comment: CC0402KRX7R7BB104)
C50  Voltage Rating: 16 V  Capacitance: 100 nF  [CAP-0402]  (hidden comment: CC0402KRX7R7BB104)
C51  Capacitance: 4.7 uF  Voltage: 25V  [CAP-0603]  (hidden comment: CC0603KRX5R8BB475)
C52  Voltage: 50 V  Capacitance: 10 nF  [CAP-0603]  (hidden comment: CC0603KPX7R9BB103)
C53  Capacitance: 1.0 uF  Voltage: 16V  [CAP-0603]  (hidden comment: CC0603KRX7R7BB105)
C54  Voltage: 50 V  Capacitance: 10 nF  [CAP-0603]  (hidden comment: CC0603KPX7R9BB103)
C55  Capacitance: 1.0 uF  Voltage: 16V  [CAP-0603]  (hidden comment: CC0603KRX7R7BB105)
C82  Capacitance: 100 nF  Voltage: 100 V  [CAP-0603]  (hidden comment: CC0603KRX7R0BB104)
D4  Forward Current: 30mA  Forward Voltage: 2V  [LED-0603]  (hidden comment: BL-HKC36G-AV-TRB)
D5  Forward Current: 30mA  Forward Voltage: 2V  [LED-0603]  (hidden comment: BL-HKC36G-AV-TRB)
F2  Fuse Current: 250mA  Voltage Rating: 32V  [RES-0603]  (hidden comment: 0467.250NRHF)
F3  Fuse Current: 250mA  Voltage Rating: 32V  [RES-0603]  (hidden comment: 0467.250NRHF)
F4  Fuse Current: 250mA  Voltage Rating: 32V  [RES-0603]  (hidden comment: 0467.250NRHF)
J2  Molex 43045-0412  [CONN-4POS-0002]  (value not drawn)
J3  Molex 43045-0412  [CONN-4POS-0002]  (value not drawn)
J4  Molex 43045-0412  [CONN-4POS-0002]  (value not drawn)
J5  Molex 43045-0612  [CONN-6POS-0001]  (value not drawn)
J6  Molex 43045-0412  [CONN-4POS-0002]  (value not drawn)
J7  Header 5  [HDR1X5]  (value not drawn)
J9  Molex 43045-0612  [CONN-6POS-0001]  (value not drawn)
J10  Molex 43045-0412  [CONN-4POS-0002]  (value not drawn)
J12  Molex 43045-0412  [CONN-4POS-0002]  (value not drawn)
J13  Molex 43045-0612  [CONN-6POS-0001]  (value not drawn)
J14  Molex 43650-0315  [43650-0315]
J15  Molex 43650-0315  [43650-0315]
Q3  Continuous Current: 200mA  Voltage: 60V  [IC-SOT23-3]  (hidden comment: T2N7002AK,LM)
Q4  Continuous Current: 200mA  Voltage: 60V  [IC-SOT23-3]  (hidden comment: T2N7002AK,LM)
R14  Power: 1/10W  Resistance: 4.7k  [RES-0603]  (hidden comment: RC0603FR-074K7L)
R15  Power: 1/10W  Resistance: 4.7k  [RES-0603]  (hidden comment: RC0603FR-074K7L)
R16  Power: 1/16W  Resistance: 470R  [RES-0402]  (hidden comment: RC0402FR-07470RL)
R17  Power: 1/16W  Resistance: 470R  [RES-0402]  (hidden comment: RC0402FR-07470RL)
R18  Power: 1/16W  Resistance: 100R  [RES-0402]  (hidden comment: RC0402FR-07100RL)
R19  Power: 1/16W  Resistance: 100R  [RES-0402]  (hidden comment: RC0402FR-07100RL)
R20  Power: 1/10W  Resistance: 4.7k  [RES-0603]  (hidden comment: RC0603FR-074K7L)
R21  Power: 1/2W  Resistance: 120R  [RES-1210]  (hidden comment: RC1210FR-07120RL)
TP7  5003  [TEST-POINT-0001]  (value not drawn)
U5  STM32G431CBT6  [IC-LQFP48]  (value not drawn)
U6  TCAN1044VDRQ1  [IC-8SOIC]

### Ports
3V3_IN (in, see TLD[2B]), 5V_IN (in, see TLD[2B], 7V_BUCK_LDOs[2B], 12V_Buck_Motor[1B]), M0_DIR (out, see TLD[2E]), M0_PWM (out, see TLD[2D]), M1_DIR (out, see TLD[2D]), M1_PWM (out, see TLD[2D]), M2_DIR (out, see TLD[2C]), M2_PWM (out, see TLD[2C])

### Nets
5V: J2.4 J3.4 J4.4 U6.3(VCC) ; port 5V_IN
GND: C48.1 C49.1 C50.1 C51.1 C52.1 C53.1 C54.1 C55.1 C82.1 J2.2 J3.2 J4.2 J5.3 J5.4 J5.6 J6.2 J6.4 J7.1 J9.3 J9.4 J9.6 J10.2 J10.4 J12.2 J12.4 J13.3 J13.4 J13.6 J14.P$1(1) J15.P$1(1) Q3.2(S) Q4.2(S) R20.2 TP7.1 U5.19(VSSA) U5.23(VSS) U5.35(VSS) U5.47(VSS) U6.2(GND)
VBAT_MCU: C48.2 C49.2 C50.2 C51.2 C52.2 C53.2 C54.2 C55.2 F2.1 F3.1 F4.1 J7.5 R14.1 R15.1 R18.2 R19.2 U5.1(VBAT) U5.20(VREF+) U5.21(VDDA) U5.24(VDD) U5.36(VDD) U5.48(VDD) U6.5(VIO) ; port 3V3_IN  [also labelled 3V3, VDD, VDDA, VREF+]
CAN_N: J14.P$3(3) J15.P$3(3) R21.2 U6.6(CANL)
CAN_P: J14.P$2(2) J15.P$2(2) R21.1 U6.7(CANH)
CAN_RX_LED: R17.2 U5.25(PB11)
CAN_STB: R20.1 U5.42(PB5) U6.8(STB)
CAN_TX_LED: R16.2 U5.26(PB12)
FDCAN_RX: U5.33(PA11) U6.4(RXD)
FDCAN_TX: U5.34(PA12) U6.1(TXD)
I2C1_SCL: J5.5 J9.5 J13.5 R15.2 U5.39(PA15)
I2C1_SDA: J5.2 J9.2 J13.2 R14.2 U5.46(PB9)
LIMIT_0_A: J6.1 U5.2(PC13)
LIMIT_0_B: J6.3 U5.3(PC14)
LIMIT_1_A: J10.1 U5.4(PC15)
LIMIT_1_B: J10.3 U5.5(PF0)
LIMIT_2_A: J12.1 U5.40(PB3)
LIMIT_2_B: J12.3 U5.41(PB4)
MOTOR_DIR: U5.27(PB13) ; port M0_DIR
MOTOR_DIR: U5.28(PB14) ; port M1_DIR  [a separate net that carries the same name]
MOTOR_DIR: U5.29(PB15) ; port M2_DIR  [a separate net that carries the same name]
NRST: C82.2 J7.2 U5.7(PG10)
PWM_IN: U5.30(PA8) ; port M0_PWM
PWM_IN: U5.31(PA9) ; port M1_PWM  [a separate net that carries the same name]
PWM_IN: U5.32(PA10) ; port M2_PWM  [a separate net that carries the same name]
QUAD_0_A: J2.1 U5.43(PB6)
QUAD_0_B: J2.3 U5.44(PB7)
QUAD_1_A: J3.1 U5.14(PA6)
QUAD_1_B: J3.3 U5.12(PA4)
QUAD_2_A: J4.1 U5.8(PA0)
QUAD_2_B: J4.3 U5.9(PA1)
SWCLK: J7.4 U5.38(PA14-SWCLK)
SWDIO: J7.3 U5.37(PA13-SWDIO)
NetD4_1: D4.1 R18.1
NetD4_2: D4.2 Q3.3(D)
NetD5_1: D5.1 R19.1
NetD5_2: D5.2 Q4.3(D)
NetF2_2: F2.2 J5.1
NetF3_2: F3.2 J9.1
NetF4_2: F4.2 J13.1
NetQ3_1: Q3.1(G) R16.1
NetQ4_1: Q4.1(G) R17.1

Not connected (* = marked no-connect by the designer): U5 6(PF1)* 10(PA2)* 11(PA3)* 13(PA5)* 15(PA7)* 16(PB0)* 17(PB1)* 18(PB2)* 22(PB10)* 45(PB8-BOOT0)*

### Layout directives
differential pair: CAN_N, CAN_P

### Notes on the sheet
- MCU
- (near J2) QUADRATURE ENCODERS
- MCU POWER FILTERING
- ABSOLUTE ENCODER I2C BUS
- CAN LEDS
- (near J6) LIMIT SWITCHES
- CONNECTORS
- (near J7) SWD DEBUG
- (near J14) CAN 1
- CAN TRANSCEIVER
- (near J15) CAN 2
- (near U6) For Diff Pair Routing CAN_P will be CANH and CAN_N will be CANL
- Supress 'Global scope object reduced to local scope'. This is intended.

### Library data of the parts
C48-C50 = CAP-0.1U-0001: CAP CER 0.1UF 16V X7R 0402; ComponentLink2Description: Datasheet; ComponentLink2URL: https://www.yageo.com/upload/media/product/productsearch/datasheet/mlcc/UPY-GPHC_X7R_6.3V-to-250V_24.pdf; Device Class: Ceramic; Size: 0402
C51 = CAP-4.7U-0001: CAP CER 4.7UF 25V X5R 0603; Device Class: Ceramic; Size: 0603
C52 C54 = CAP-10N-0002: CAP CER 10000PF 50V X7R 0603; ComponentLink2Description: Datasheet; ComponentLink2URL: http://www.yageo.com/documents/recent/UPY-GPHC_X7R_6.3V-to-50V_18.pdf; Device Class: Ceramic; Size: 0603
C53 C55 = CAP-1U-0002: CAP CER 1UF 16V X7R 0603; Device Class: Ceramic; Size: 0603
C82 = CAP-100N-0001: CAP CER 0.1UF 100V X7R 0603; Device Class: Ceramic; Size: 0603; ComponentLink1Description: Datasheet; ComponentLink1URL: https://www.yageo.com/upload/media/product/app/datasheet/mlcc/upy-np0x7r_mv_100-to-630v.pdf
D4 D5 = LED-0001: LED YELLOW CLEAR 0603 SMD; ComponentLink1Description: Datasheet; ComponentLink1URL: https://www.americanbrightled.com/pdffiles/led-components/smt/BL-HKC36G-AV-TRB.pdf
F2-F4 = FUSE-0002: FUSE BRD MT 250MA 32VAC 32VDC; ComponentLink2Description: Datasheet; ComponentLink2URL: https://www.littelfuse.com/media?resourcetype=datasheets&itemid=4a59f034-1cca-460e-a5ba-e1e66247c76d&filename=littelfuse_fuse_467_datasheet.pdf
J2-J4 J6 J10 J12 = CONN-4POS-0002: CONN HEADER VERT 4POS 3MM; ComponentLink1Description: Datasheet; ComponentLink1URL: https://www.molex.com/content/dam/molex/molex-dot-com/products/automated/en-us/salesdrawingpdf/430/43045/430450412_sd.pdf?inline
J5 J9 J13 = CONN-6POS-0001: CONN HEADER VERT 6POS 3MM; ComponentLink1Description: Datasheet; ComponentLink1URL: https://tools.molex.com/pdm_docs/ps/PS-43045.pdf
J7 = Header 5: Header, 5-Pin; LatestRevisionDate: 17-Jul-2002; LatestRevisionNote: Re-released for DXP Platform.; Publisher: Altium Limited
J14 J15 = Micro-Fit Molex 3 Pin Vertical: GateName_1: G$1; SymbolName_1: HEADER_POS3; DeviceSetName: HEADER_POS3_?; DeviceName: 43650-0315; LibraryName: con-molex-micro-fit-3_0_2; Package: 43650-0315
Q3 Q4 = NMOS-200MA-0001: MOSFET N-CH 60V 200MA SOT23; ComponentLink1Description: Datasheet; ComponentLink1URL: https://toshiba.semicon-storage.com/info/T2N7002AK_datasheet_en_20150401.pdf?did=29712&prodName=T2N7002AK
R14 R15 R20 = RES-4.7k-0001: RES 4.7K OHM 1% 1/10W 0603; Tolerance: 1%; Size: 0603; ComponentLink1Description: Datasheet; ComponentLink1URL: https://www.yageo.com/upload/media/product/products/datasheet/rchip/PYu-RC_Group_51_RoHS_L_12.pdf
R16 R17 = RES-470-0001: RES 470 OHM 1% 1/16W 0402; Tolerance: 1%; Size: 0402; ComponentLink1Description: Datasheet; ComponentLink1URL: https://www.yageo.com/upload/media/product/products/datasheet/rchip/PYu-RC_Group_51_RoHS_L_12.pdf
R18 R19 = RES-100-0001: RES 100 OHM 1% 1/16W 0402; Tolerance: 1%; Size: 0402; ComponentLink1Description: Datasheet; ComponentLink1URL: https://www.yageo.com/upload/media/product/products/datasheet/rchip/PYu-RC_Group_51_RoHS_L_12.pdf
R21 = RES-120-0001: RES 120 OHM 1% 1/2W 1210; Tolerance: 1%; Size: 1210; ComponentLink1Description: Datasheet; ComponentLink1URL: https://www.yageo.com/upload/media/product/products/datasheet/rchip/PYu-RC_Group_51_RoHS_L_12.pdf
TP7 = TEST-POINT-0001: as TP1 on sheet Input_Power
U5 = IC-STM32G431CBT6: IC MCU 32BIT 128KB FLASH 48LQFP; Package: 48LQFP; ComponentLink1Description: Datasheet; ComponentLink1URL: https://www.st.com/resource/en/datasheet/stm32g431cb.pdf
U6 = IC-CAN-0001: IC TRANSCEIVER 1/1 8SOIC; ComponentLink1Description: Datasheet; ComponentLink1URL: https://www.ti.com/lit/ds/symlink/tcan1044-q1.pdf?HQS=dis-dk-null-digikeymode-dsf-pf-null-wwe&ts=1728758303289&ref_url=https%253A%252F%252Fwww.ti.com%252Fgeneral%252Fdocs%252Fsuppproductinfo.tsp%253FdistId%253D10%2526gotoUrl%253Dhttps%253A%252F%252Fwww.ti.com%252Flit%252Fgpn%252Ftcan1044-q1